# EasyEDA Pro project ZIAD_DBW_PROJECT_EDIT_9_MAY_2025.epro, schematic SteeringBoard4.1
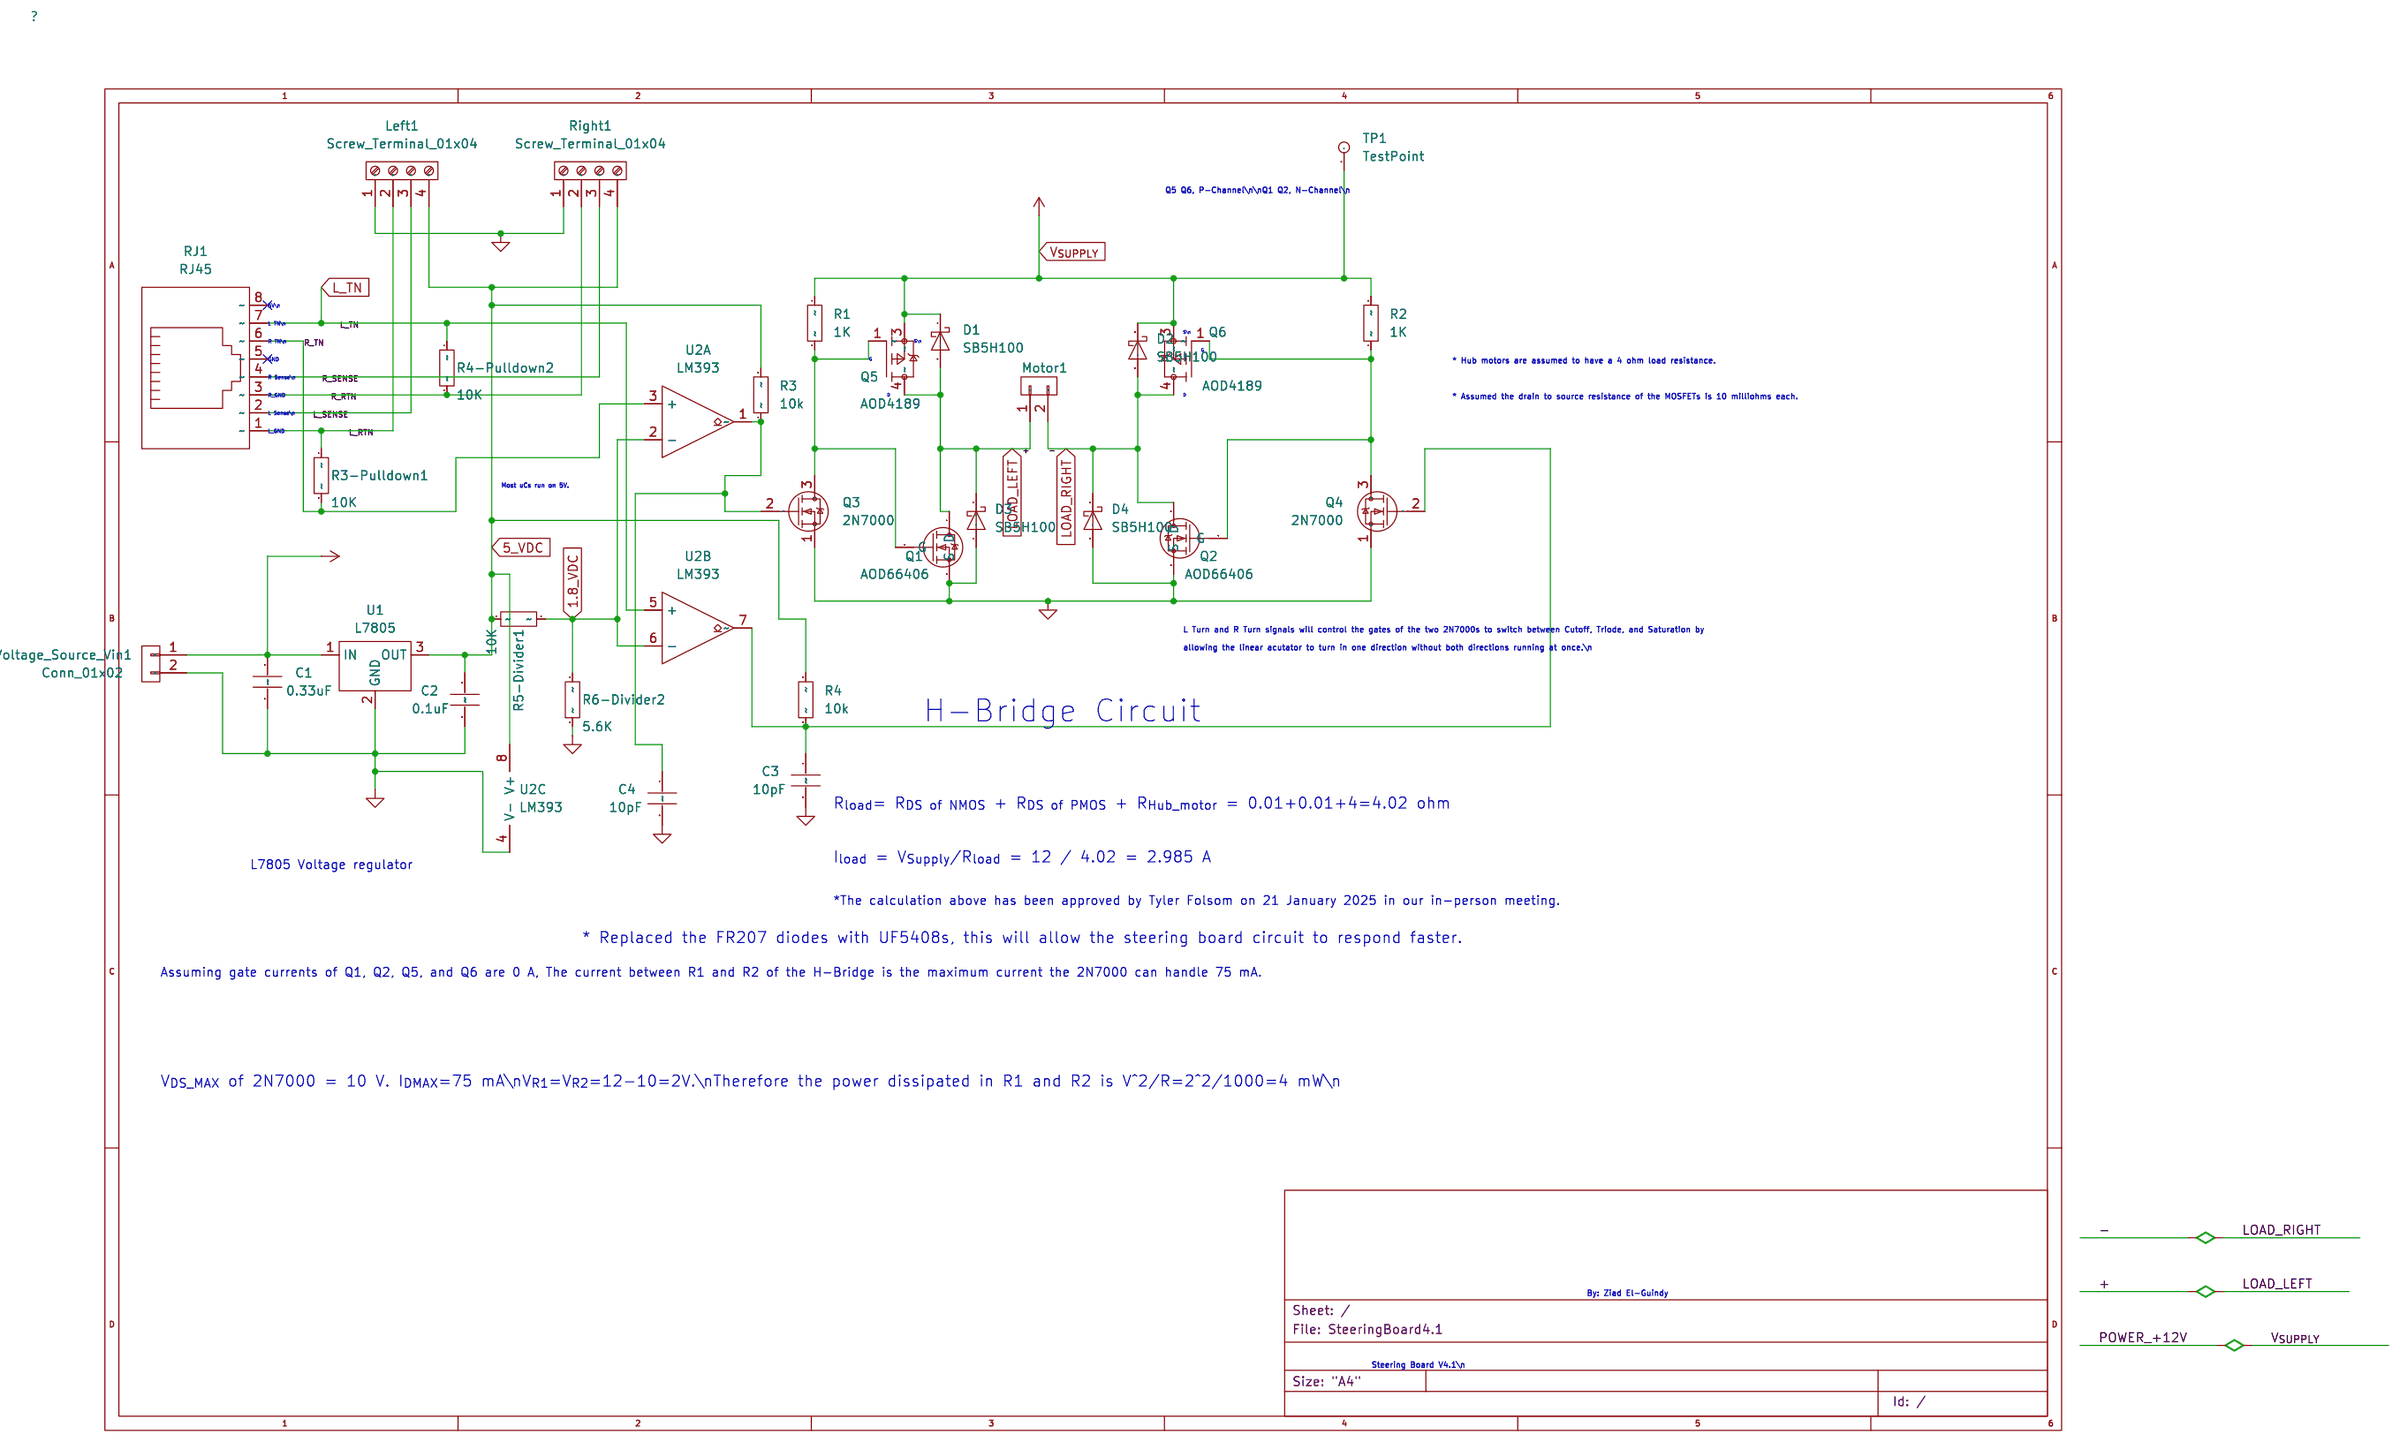
[diagram p0: schematic sheet]

## Parts
C1  0.33uF
C2  0.1uF
C3  10pF
C4  10pF
D1  SB5H100
D2  SB5H100
D3  SB5H100
D4  SB5H100
Left1  Screw_Terminal_01x04
Motor1  Conn_01x02
Q1  AOD66406
Q2  AOD66406
Q3  2N7000
Q4  2N7000
Q5  AOD4189
Q6  AOD4189
R1  1K
R2  1K
R3  10k
R3-Pulldown1  10K
R4  10k
R4-Pulldown2  10K
R5-Divider1  10K
R6-Divider2  5.6K
Right1  Screw_Terminal_01x04
RJ1  RJ45
TP1  TestPoint
U1  L7805
U2  LM393  (sections 1,2,3)
Voltage_Source_Vin1  Conn_01x02

## Library data of the parts
C1-C4 = DEV-15795_C
D1-D4 = Diode_SB5H100: User doc link: https://www.vishay.com/docs/88722/sb5h90.pdf
Left1 Right1 = Connector_Screw_Terminal_01x04
Motor1 Voltage_Source_Vin1 = Connector_Generic_Conn_01x02
Q1 Q2 = Simulation_SPICE_NMOS: User doc link: https://ngspice.sourceforge.io/docs/ngspice-manual.pdf; Sim_Device: NMOS; Sim_Type: VDMOS; Sim_Pins: 1=D 2=G 3=S; Sim.Device: NMOS; Sim.Type: VDMOS; Sim.Pins: 1=D 2=G 3=S
Q3 Q4 = Transistor_FET_2N7000: User doc link: https://www.vishay.com/docs/70226/70226.pdf
Q5 Q6 = AOD4189_AOD4189: \nP-Channel 40V 40A (Tc) 2.5W (Ta), 62.5W (Tc) Surface Mount TO-252, (D-Pak)\n; MF: Alpha &; Package1: TO-252 Alpha &amp; Omega Semiconductor; Price: None; SnapEDA_Link: https://www.snapeda.com/parts/AOD4189/Alpha+%2526+Omega+Semiconductor+Inc./view-part/?ref=snap; Availability: In Stock; Check_prices: https://www.snapeda.com/parts/AOD4189/Alpha+%2526+Omega+Semiconductor+Inc./view-part/?ref=eda
R1 R2 R3-Pulldown1 R4-Pulldown2 R5-Divider1 R6-Divider2 = DEV-15795_R
R3 R4 = Device_R
RJ1 = Connector_RJ45
TP1 = Connector_TestPoint
U1 = Regulator_Linear_L7805: User doc link: http://www.st.com/content/ccc/resource/technical/document/datasheet/41/4f/b3/b0/12/d4/47/88/CD00000444.pdf/files/CD00000444.pdf/jcr:content/translations/en.CD00000444.pdf
U2 = Comparator_LM393: User doc link: http://www.ti.com/lit/ds/symlink/lm393.pdf

## Nets
1.8_VDC: R5-Divider1.1 R6-Divider2.1 U2.2(-) U2.6(-)
5_VDC: C2.1 Left1.4(Pin) R3.2 R4.2 R5-Divider1.2 Right1.4(Pin) U1.3(OUT) U2.8(V+)
+: D1.2(A) D3.1(K) Motor1.1(Pin) Q1.1(D) Q5.4
-: D2.2(A) D4.1(K) Motor1.2(Pin) Q2.1(D) Q6.4
L_RTN: Left1.2(Pin) R3-Pulldown1.1 RJ1.1
L_SENSE: Left1.3(Pin) RJ1.2
L_TN: R4-Pulldown2.1 RJ1.7 U2.5(+)
POWER_+12V: C1.1 D1.1(K) D2.1(K) Q5.3 Q6.3 R1.1 R2.2 TP1.1 U1.1(IN) Voltage_Source_Vin1.1(Pin)
POWER_GND: C1.2 C2.2 C3.2 C4.2 D3.2(A) D4.2(A) Left1.1(Pin) Q1.3(S) Q2.3(S) Q3.1(S) Q4.1(S) R6-Divider2.2 Right1.1(Pin) U1.2(GND) U2.4(V-) Voltage_Source_Vin1.2(Pin)
R_RTN: R4-Pulldown2.2 Right1.2(Pin) RJ1.3
R_SENSE: Right1.3(Pin) RJ1.4
R_TN: R3-Pulldown1.2 RJ1.6 U2.3(+)
Net-(C3-1): C3.1 Q4.2(G) R4.1 U2.7
Net-(C4-1): C4.1 Q3.2(G) R3.1 U2.1
Net-(Q1-2): Q1.2(G) Q3.3(D) Q5.1 R1.2
Net-(Q2-2): Q2.2(G) Q4.3(D) Q6.1 R2.1

Not connected (* = marked no-connect by the designer): RJ1 5* 8*

## Notes on the sheet
- Q5 Q6, P-Channel\n\nQ1 Q2, N-Channel\n
- 5V\n
- L TN\n
- S\n
- R TN\n
- S\n
- G
- GND
- G
- * Hub motors are assumed to have a 4 ohm load resistance.
- R Sense\n
- R_GND
- D
- D
- * Assumed the drain to source resistance of the MOSFETs is 10 milliohms each.
- L Sense\n
- L_GND
- Most uCs run on 5V.
- L Turn and R Turn signals will control the gates of the two 2N7000s to switch between Cutoff, Triode, and Saturation by
- allowing the linear acutator to turn in one direction without both directions running at once.\n
- H-Bridge Circuit
- R_{load}= R_{DS of NMOS} + R_{DS of PMOS} + R_{Hub_motor} = 0.01+0.01+4=4.02 ohm
- L7805 Voltage regulator
- I_{load} = V_{Supply}/R_{load} = 12 / 4.02 = 2.985 A
- *The calculation above has been approved by Tyler Folsom on 21 January 2025 in our in-person meeting.
- * Replaced the FR207 diodes with UF5408s, this will allow the steering board circuit to respond faster.
- Assuming gate currents of Q1, Q2, Q5, and Q6 are 0 A, The current between R1 and R2 of the H-Bridge is the maximum current the 2N7000 can handle 75 mA.
- V_{DS_MAX} of 2N7000 = 10 V. I_{D_{MAX}}=75 mA\nV_{R_{1}}=V_{R_{2}}=12-10=2V.\nTherefore the power dissipated in R1 and R2 is V^2/R=2^2/1000=4 mW\n
- By: Ziad El-Guindy
- Steering Board V4.1\n
